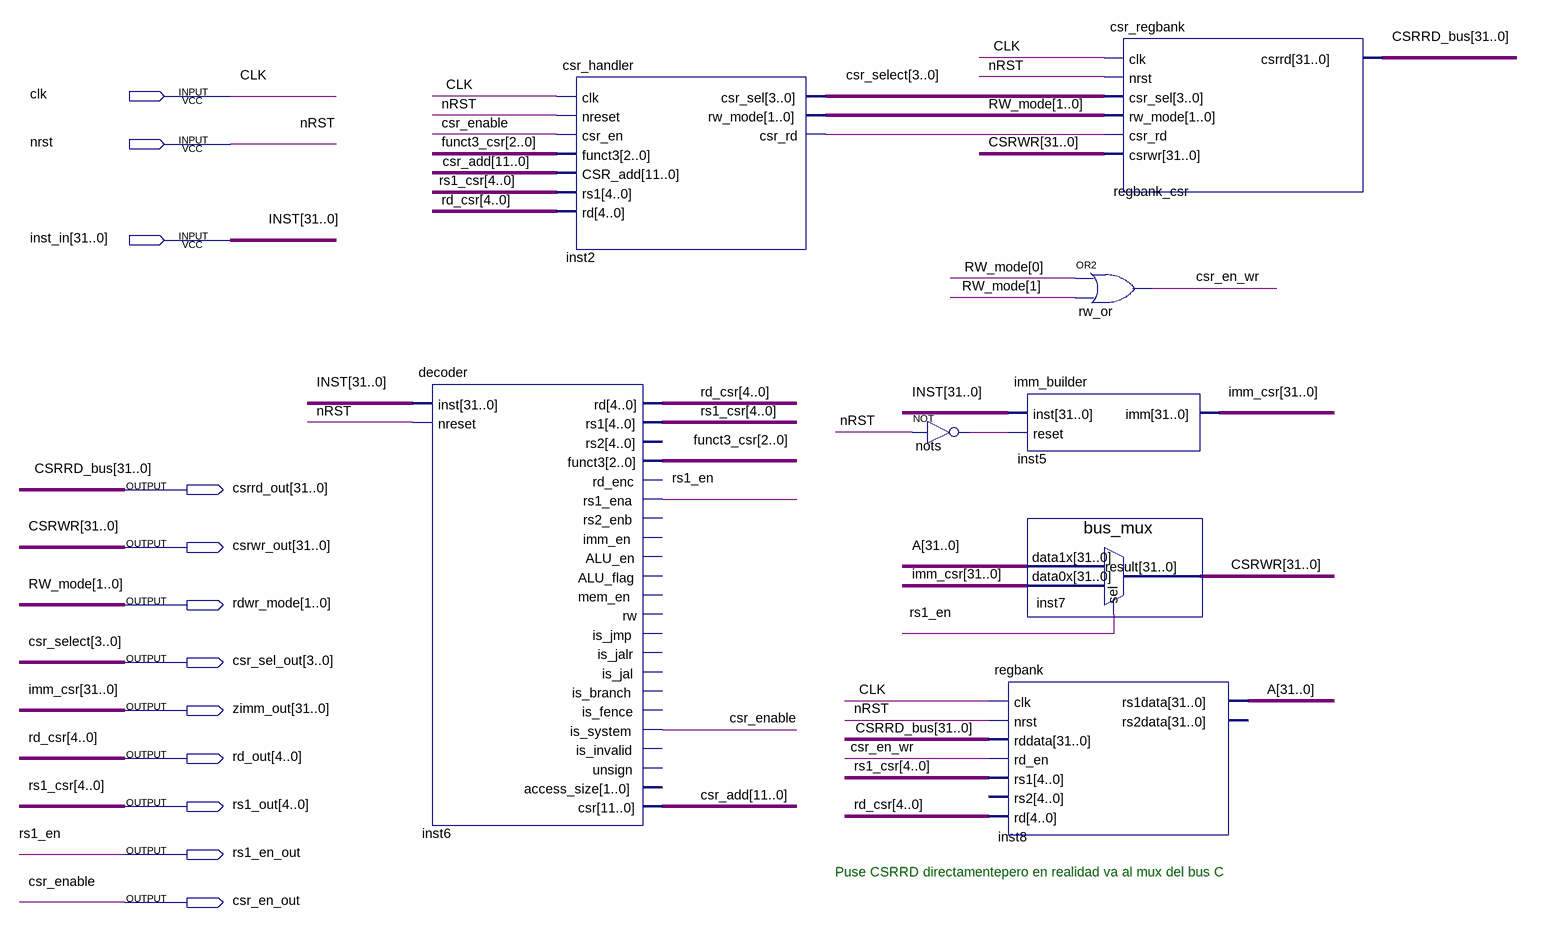
[diagram p0: schematic sheet]
// Quartus schematic csr_full_test.bdf as structural Verilog: 8 symbols, 12 pins
module csr_full_test (
  input  clk,
  input  nrst,
  input  [31:0] inst_in,
  output [31:0] csrrd_out,
  output [31:0] csrwr_out,
  output [1:0] rdwr_mode,
  output [3:0] csr_sel_out,
  output [31:0] zimm_out,
  output [4:0] rd_out,
  output [4:0] rs1_out,
  output rs1_en_out,
  output csr_en_out
);

  wire csr_en_wr, inst2_csr_rd, nots_out;
  wire [2:0] funct3_csr;
  wire [11:0] csr_add;
  wire [31:0] A;

  decoder inst6 (
    .inst(inst_in), .nreset(nrst), .rd(rd_out), .rs1(rs1_out), .funct3(funct3_csr), .rs1_ena(rs1_en_out),
    .is_system(csr_en_out), .csr(csr_add));  // open: rs2, rd_enc, rs2_enb, imm_en, ALU_en, ALU_flag, mem_en, rw, is_jmp, is_jalr, is_jal, is_branch, is_fence, is_invalid, unsign, access_size
  csr_handler inst2 (
    .clk(clk), .nreset(nrst), .csr_en(csr_en_out), .funct3(funct3_csr), .CSR_add(csr_add), .rs1(rs1_out),
    .rd(rd_out), .csr_sel(csr_sel_out), .rw_mode(rdwr_mode), .csr_rd(inst2_csr_rd));
  not nots (nots_out, nrst);
  imm_builder inst5 (.inst(inst_in), .reset(nots_out), .imm(zimm_out));
  bus_mux inst7 (.data1x(A), .data0x(zimm_out), .sel(rs1_en_out), .result(csrwr_out));
  regbank inst8 (
    .clk(clk), .nrst(nrst), .rddata(csrrd_out), .rd_en(csr_en_wr), .rs1(rs1_out), .rd(rd_out), .rs1data(A));  // open: rs2, rs2data
  csr_regbank regbank_csr (
    .clk(clk), .nrst(nrst), .csr_sel(csr_sel_out), .rw_mode(rdwr_mode), .csr_rd(inst2_csr_rd),
    .csrwr(csrwr_out), .csrrd(csrrd_out));
  or rw_or (csr_en_wr, rdwr_mode[0], rdwr_mode[1]);

  // Other names for the same wires on the sheet: csr_enable = csr_en_out; csr_select[3:0] = csr_sel_out;
  //   CSRRD_bus[31:0] = csrrd_out; CSRWR[31:0] = csrwr_out; imm_csr[31:0] = zimm_out; INST[31:0] = inst_in;
  //   rd_csr[4:0] = rd_out; rs1_csr[4:0] = rs1_out; rs1_en = rs1_en_out; RW_mode[1:0] = rdwr_mode

  // Notes on the sheet:
  //   Puse CSRRD directamentepero en realidad va al mux del bus C
endmodule
